# EAGLE design scheme (EAGLE 5.10)
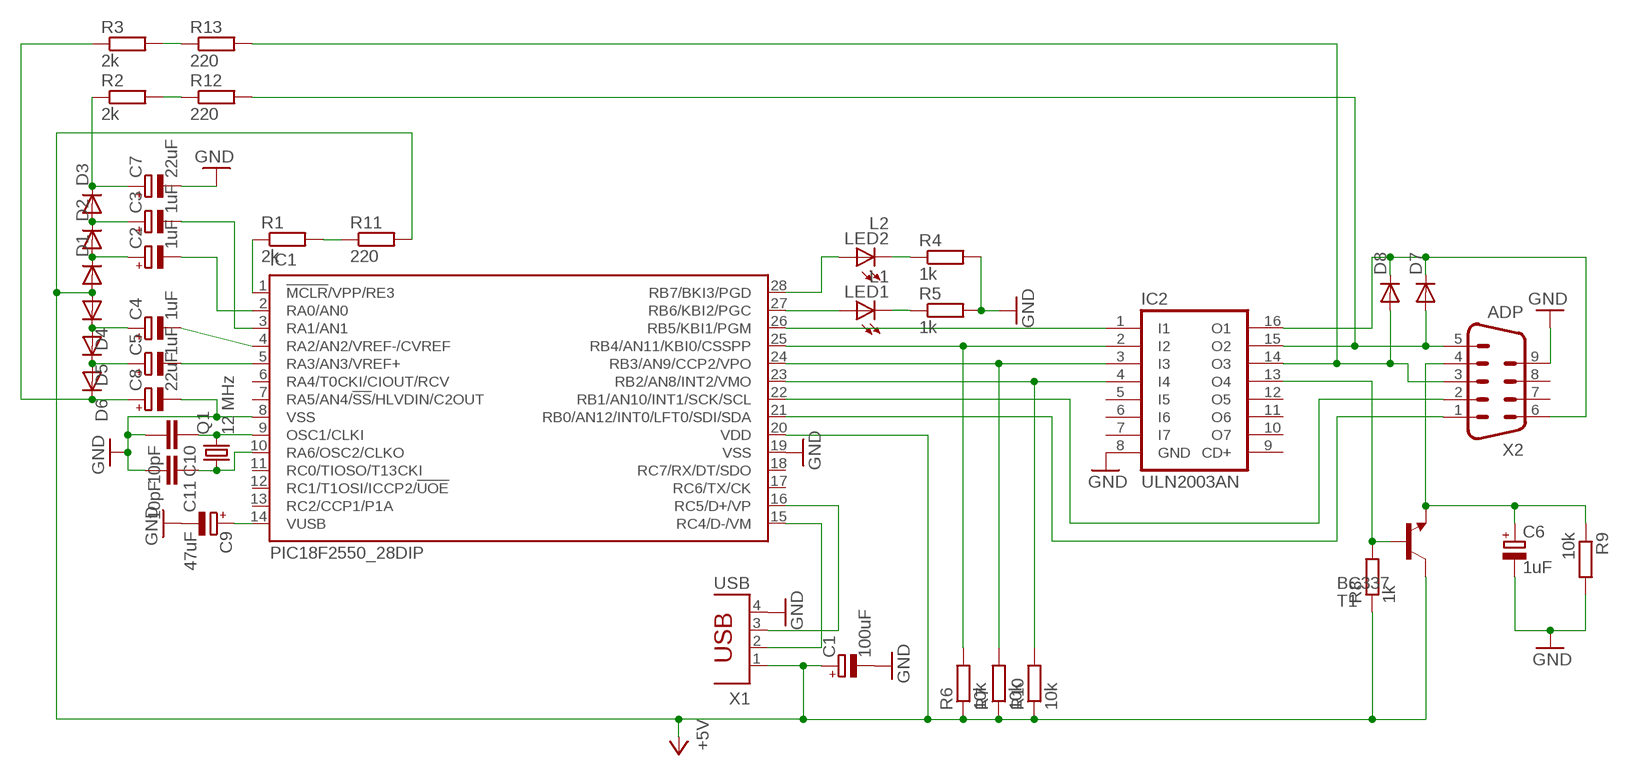
[diagram p0: schematic, sheet 1]

## Parts
C1  100uF  CPOL-EUE2,5-6E  [E2,5-6E]
C2  1uF  CPOL-EUE2-5  [E2-5]
C3  1uF  CPOL-EUE2-5  [E2-5]
C4  1uF  CPOL-EUE2-5  [E2-5]
C5  1uF  CPOL-EUE2-5  [E2-5]
C6  1uF  CPOL-EUE2-5  [E2-5]
C7  22uF  CPOL-EUE2-5  [E2-5]
C8  22uF  CPOL-EUE2-5  [E2-5]
C9  47uF  CPOL-EUE2,5-6E  [E2,5-6E]
C10  10pF  C-EU050-024X044  [C050-024X044]
C11  10pF  C-EU050-024X044  [C050-024X044]
D1  1N4148DO35-7  [DO35-7]
D2  1N4148DO35-7  [DO35-7]
D3  1N4148DO35-7  [DO35-7]
D4  1N4148DO35-7  [DO35-7]
D5  1N4148DO35-7  [DO35-7]
D6  1N4148DO35-7  [DO35-7]
D7  1N4148DO35-7  [DO35-7]
D8  1N4148DO35-7  [DO35-7]
IC1  PIC18F2550_28DIP  [DIL28-3]
IC2  ULN2003AN  [DIL16]
LED1  L1  LED5MM  [LED5MM]
LED2  L2  LED5MM  [LED5MM]
Q1  12 MHz  CRYSTALHC49S  [HC49/S]
R1  2k  R-EU_0204/7  [0204/7]
R2  2k  R-EU_0204/7  [0204/7]
R3  2k  R-EU_0204/7  [0204/7]
R4  1k  R-EU_0204/7  [0204/7]
R5  1k  R-EU_0204/7  [0204/7]
R6  10k  R-EU_0204/7  [0204/7]
R7  10k  R-EU_0204/7  [0204/7]
R8  1k  R-EU_0204/7  [0204/7]
R9  10k  R-EU_0204/7  [0204/7]
R10  10k  R-EU_0204/7  [0204/7]
R11  220  R-EU_0204/7  [0204/7]
R12  220  R-EU_0204/7  [0204/7]
R13  220  R-EU_0204/7  [0204/7]
T1  BC337  [TO92]
X1  USB  PN87520  [PN87520]
X2  ADP  M09-182  [182-009-MALE]

## Nets
+5V: C1.+ D1.A D4.A IC1.20(VDD) R6.1 R7.1 R8.1 R10.1 R11.2 T1.3(C) X1.1
GND: C1.- C6.- C7.- C8.- C9.- C10.2 C11.2 IC1.8(VSS) IC1.19(VSS) IC2.8(GND) R4.2 R5.2 R9.2 X1.4 X2.9
N$1: IC1.15(RC4/D-/VM) X1.2
N$2: IC1.16(RC5/D+/VP) X1.3
N$3: IC1.27(RB6/KBI2/PGC) LED1.A
N$4: C9.+ IC1.14(VUSB)
N$5: IC1.1(!MCLR!/VPP/RE3) R1.1
N$6: C2.+ D1.C D2.A
N$7: R1.2 R11.1
N$8: C2.- IC1.2(RA0/AN0)
N$9: C3.+ D2.C D3.A
N$10: C3.- IC1.3(RA1/AN1)
N$11: C10.1 IC1.9(OSC1/CLKI) Q1.2
N$12: C7.+ D3.C R2.1
N$13: R2.2 R12.1
N$14: C4.- IC1.4(RA2/AN2/VREF-/CVREF)
N$15: C4.+ D4.C D5.A
N$16: C5.- IC1.5(RA3/AN3/VREF+)
N$18: R3.2 R13.1
N$19: C11.1 IC1.10(RA6/OSC2/CLKO) Q1.1
N$21: IC1.24(RB3/AN9/CCP2/VPO) IC2.3(I3) R7.2
N$22: LED2.K(C) R4.1
N$23: LED1.K(C) R5.1
N$24: IC1.28(RB7/BKI3/PGD) LED2.A
N$26: D7.A IC2.15(O2) R12.2 X2.5
N$27: IC1.23(RB2/AN8/INT2/VMO) IC2.4(I4) R10.2
N$28: D7.C D8.C IC2.16(O1) X2.6
N$29: IC1.26(RB5/KBI1/PGM) IC2.1(I1)
N$30: D8.A IC2.14(O3) R13.2 X2.3
N$31: IC1.25(RB4/AN11/KBI0/CSSPP) IC2.2(I2) R6.2
N$33: C5.+ D5.C D6.A
N$35: C8.+ D6.C R3.1
N$40: IC2.13(O4) R8.2 T1.2(B)
N$41: IC1.22(RB1/AN10/INT1/SCK/SCL) X2.2
N$42: C6.+ R9.1 T1.1(E) X2.4
N$43: IC1.21(RB0/AN12/INT0/LFT0/SDI/SDA) X2.1
Unconnected: IC1.6(RA4/T0CKI/CIOUT/RCV) IC1.7(RA5/AN4/!SS!/HLVDIN/C2OUT) IC1.11(RC0/TIOSO/T13CKI) IC1.12(RC1/T1OSI/ICCP2/!UOE) IC1.13(RC2/CCP1/P1A) IC1.17(RC6/TX/CK) IC1.18(RC7/RX/DT/SDO) IC2.5(I5) IC2.6(I6) IC2.7(I7) IC2.9(CD+) IC2.10(O7) IC2.11(O6) IC2.12(O5) X2.7 X2.8

## Library data of the parts
C1-C9 = resistor:CPOL-EU: POLARIZED CAPACITOR, European symbol
C10 C11 = resistor:C-EU: CAPACITOR, European symbol
D1-D8 = diode:1N4148: DIODE high speed (Philips)
IC1 = microchip:PIC18F2*_28: USB Microcontrollers with nanoWatt Technology High-Performance, Enhanced Flash, 28/40/44-Pin, Source: http://ww1.microchip.com/downloads/en/devicedoc/39632c.pdf
IC2 = uln-udn:ULN2003A: DRIVER ARRAY
LED1 LED2 = led:LED: LED OSRAM: - CHIPLED LG R971, LG N971, LY N971, LG Q971, LY Q971, LO R971, LY R971 LH N974, LH R974 LS Q976, LO Q976, LY Q976 LO Q996 - Hyper CHIPLED LW Q18S LB Q993, LB Q99A, LB R99A - SideLED LS A670, LO A670, LY A670, LG A670, LP A670 LB A673, LV A673, LT A673, LW A673 LH A674 LY A675 LS A676, LA A676, LO A676, LY A676, LW A676 LS A679, LY A679, LG A679 - Hyper Micro SIDELED® LS Y876, LA Y876, LO Y876, LY Y876 LT Y87S - SmartLED LW L88C, LW L88S LB L89C, LB L89S, LG L890 LS L89K, LO L89K, LY L89K LS L896, LA L896, LO L896, LY L896 - TOPLED LS T670, LO T670, LY T670, LG T670, LP T670 LSG T670, LSP T670, LSY T670, LOP T670, LYG T670 LG T671, LOG T671, LSG T671 LB T673, LV T673, LT T673, LW T673 LH T674 LS T676, LA T676, LO T676, LY T676, LB T676, LH T676, LSB T676, LW T676 LB T67C, LV T67C, LT T67C, LS T67K, LO T67K, LY T67K, LW E67C LS E67B, LA E67B, LO E67B, LY E67B, LB E67C, LV E67C, LT E67C LW T67C LS T679, LY T679, LG T679 LS T770, LO T770, LY T770, LG T770, LP T770 LB T773, LV T773, LT T773, LW T773 LH T774 LS E675, LA E675, LY E675, LS T675 LS T776, LA T776, LO T776, LY T776, LB T776 LHGB T686 LT T68C, LB T68C - Hyper Mini TOPLED® LB M676 - Mini TOPLED Santana® LG M470 LS M47K, LO M47K, LY M47K Source: http://www.osram.convergy.de LUXEON: - LUMILED® LXK2-PW12-R00, LXK2-PW12-S00, LXK2-PW14-U00, LXK2-PW14-V00 LXK2-PM12-R00, LXK2-PM12-S00, LXK2-PM14-U00 LXK2-PE12-Q00, LXK2-PE12-R00, LXK2-PE12-S00, LXK2-PE14-T00, LXK2-PE14-U00 LXK2-PB12-K00, LXK2-PB12-L00, LXK2-PB12-M00, LXK2-PB14-N00, LXK2-PB14-P00, LXK2-PB14-Q00 LXK2-PR12-L00, LXK2-PR12-M00, LXK2-PR14-Q00, LXK2-PR14-R00 LXK2-PD12-Q00, LXK2-PD12-R00, LXK2-PD12-S00 LXK2-PH12-R00, LXK2-PH12-S00 LXK2-PL12-P00, LXK2-PL12-Q00, LXK2-PL12-R00 Source: www.luxeon.com KINGBRIGHT: KA-3528ASYC Source: www.kingbright.com
Q1 = crystal:CRYSTAL: CRYSTAL
R1-R13 = resistor:R-EU_: RESISTOR, European symbol
T1 = transistor:BC337: NPN TRANSISTOR
X1 = con-berg:PN87520: BERG USB connector
X2 = con-subd:M09: SUB-D

## Board
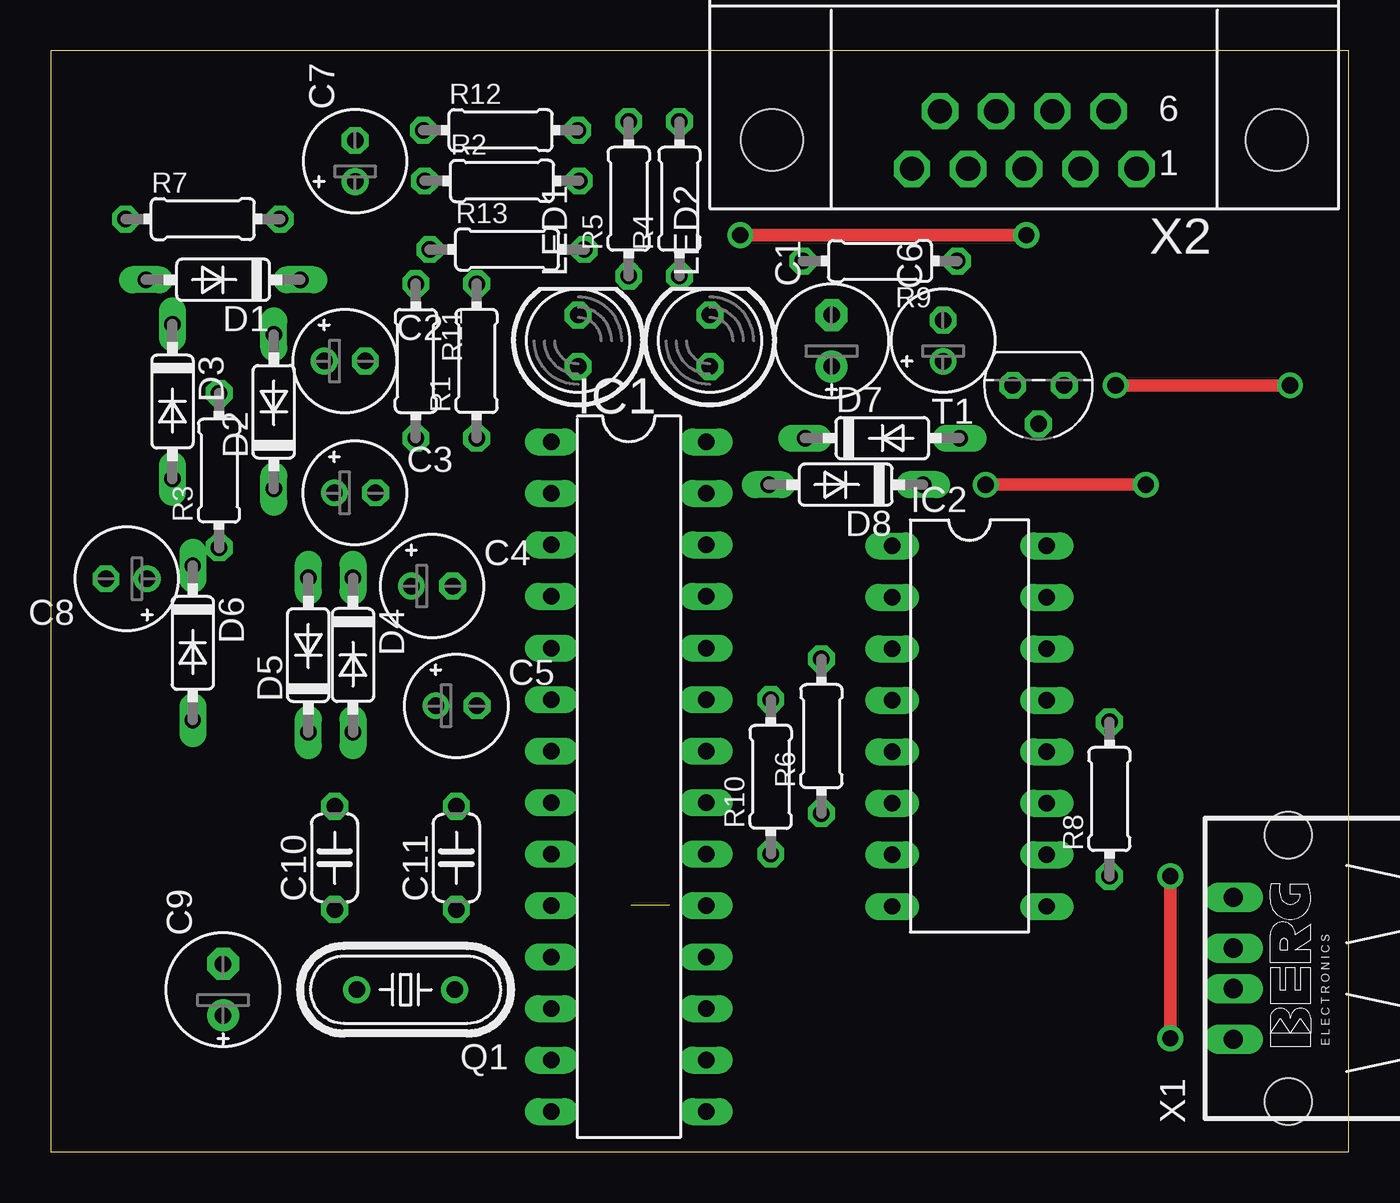
[diagram p1: board, top side]
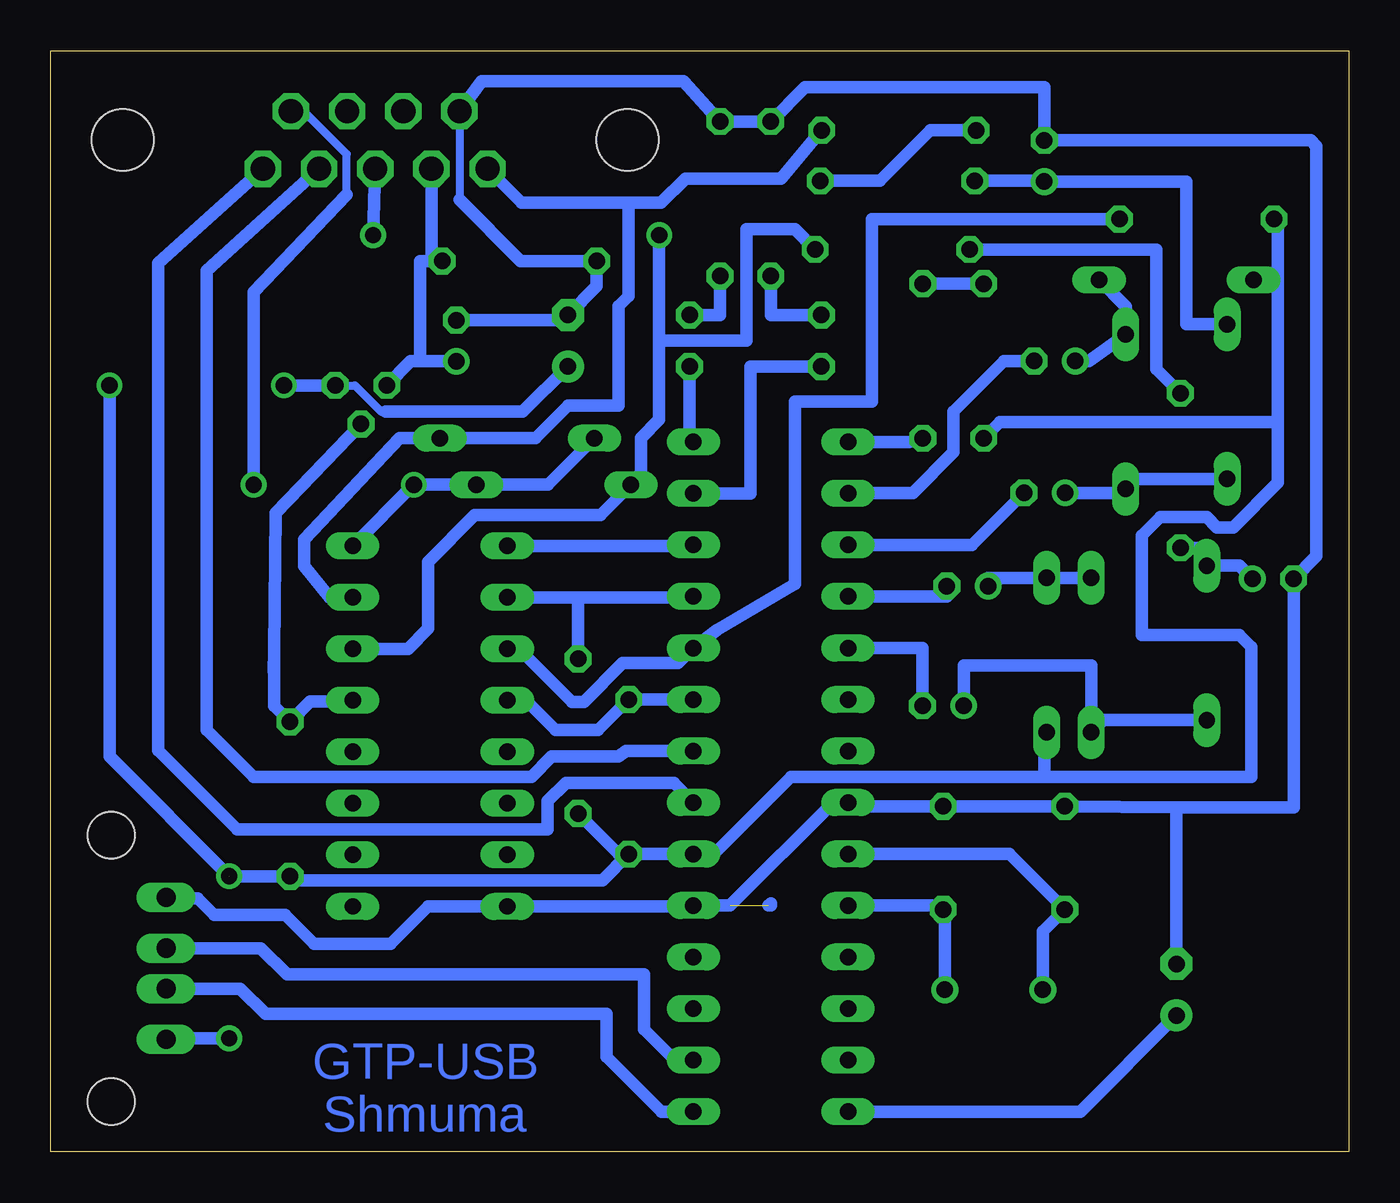
[diagram p2: board, bottom side, seen from below]

Size 64 x 54.3 mm. Coordinates in mm from the lower left corner, seen from the top.
Outline: 0,0 64,0 64,54.3 0,54.3 0,0
Copper layers (1*16): Top 0.035mm / dielectric 1.5mm / Bottom 0.035mm
Design rules "default": minimum track width 10mil, minimum drill 24mil, track to track 8mil, track to pad 8mil, pad to pad 8mil, via to via 8mil, smd to smd 8mil, copper to edge 40mil, drill to drill 8mil, minimum pad ring 10mil, minimum via ring 8mil, stop-mask expansion 4mil, vias tented up to drill 0mil, thermal gap 10mil

### Footprints (pad centres in the part's own frame; a part is rotated, then mirrored left to right if it is on the bottom)
E2,5-6E = drill 0.813 pad 1.575 round: + -1.27,0 | drill 0.813 pad 1.575 octagon: - 1.27,0
E2-5 = drill 0.813 pad 1.27 round: + -1.016,0 | drill 0.813 pad 1.27 octagon: - 1.016,0
C050-024X044 = drill 0.813 octagon: 1 -2.54,0; 2 2.54,0
DO35-7 = drill 0.813 long: A 3.81,0; C -3.81,0
DIL28-3 = drill 0.813 long: 1 -16.51,-3.81; 2 -13.97,-3.81; 3 -11.43,-3.81; 4 -8.89,-3.81; 5 -6.35,-3.81; 6 -3.81,-3.81; 7 -1.27,-3.81; 8 1.27,-3.81; 9 3.81,-3.81; 10 6.35,-3.81; 11 8.89,-3.81; 12 11.43,-3.81; 13 13.97,-3.81; 14 16.51,-3.81; 15 16.51,3.81; 16 13.97,3.81; 17 11.43,3.81; 18 8.89,3.81; 19 6.35,3.81; 20 3.81,3.81; 21 1.27,3.81; 22 -1.27,3.81; 23 -3.81,3.81; 24 -6.35,3.81; 25 -8.89,3.81; 26 -11.43,3.81; 27 -13.97,3.81; 28 -16.51,3.81
DIL16 = drill 0.813 long: 1 -8.89,-3.81; 2 -6.35,-3.81; 3 -3.81,-3.81; 4 -1.27,-3.81; 5 1.27,-3.81; 6 3.81,-3.81; 7 6.35,-3.81; 8 8.89,-3.81; 9 8.89,3.81; 10 6.35,3.81; 11 3.81,3.81; 12 1.27,3.81; 13 -1.27,3.81; 14 -3.81,3.81; 15 -6.35,3.81; 16 -8.89,3.81
LED5MM = drill 0.813 octagon: A -1.27,0; K 1.27,0
HC49/S = drill 0.813 round: 1 -2.413,0; 2 2.413,0
0204/7 = drill 0.813 octagon: 1 -3.81,0; 2 3.81,0
TO92 = drill 0.813 octagon: 1 1.27,0; 2 0,1.905; 3 -1.27,0
PN87520 = drill 0.95 long: 1 -3.5,2.71; 2 -1,2.71; 3 1,2.71; 4 3.5,2.71 | hole 2.3: -6.57,0; 6.57,0
182-009-MALE = drill 1.194 pad 1.524 octagon: 1 -5.537,10.923; 2 -2.769,10.923; 3 0,10.923; 4 2.769,10.923; 5 5.537,10.923; 6 -4.153,8.08; 7 -1.384,8.08; 8 1.384,8.08; 9 4.153,8.08 | hole 3.048: -12.446,9.501; 12.446,9.501

### Placement (x,y rotation side)
C1  38.5,40 90 top
C2  14.5,39 0 top
C3  15,32.5 0 top
C4  18.8,27.9 0 top
C5  20,22 0 top
C6  44,40 90 top
C7  15.01,48.86 90 top
C8  3.74,28.26 180 top
C9  8.5,8 90 top
C10  14,14.5 90 top
C11  20,14.5 90 top
D1  8.5,43 180 top
D2  11,36.5 90 top
D3  6,37 270 top
D4  14.9,24.5 270 top
D5  12.7,24.5 90 top
D6  7,25.1 270 top
D7  41,35.2 0 top
D8  39.2,32.9 180 top
IC1  28.5,18.5 270 top
IC2  45.3,21 270 top
LED1  26,40 90 top
LED2  32.5,40 90 top
Q1  17.5,8 180 top
R1  21,39 90 top
R2  22.25,47.88 0 top
R3  8.3,33.6 90 top
R4  31,47 90 top
R5  28.5,47 90 top
R6  38,20.5 90 top
R7  7.5,46 0 top
R8  52.2,17.4 90 top
R9  40.89,43.93 180 top
R10  35.5,18.5 90 top
R11  18,39 270 top
R12  22.18,50.38 0 top
R13  22.5,44.5 0 top
T1  48.7,37.8 180 top
X1  61.02,9.05 90 top
X2  48,59.4 180 top

### Tracks (layer width: path | path; a pad name or v marks a point on that pad's centre or on a via)
+5V  (via drill 0.8 pad 1.27)  (1 unrouted)
  Top 0.61: v61.1,37.8 v52.5,37.8 | v55.2,5.6 v55.2,13.6
  Bottom 0.406: 47.5,36.5 47.7,36.5 49,37.8 T1.3
  Bottom 0.61: R10.1 IC1.20 31.31,14.69 27.5,18.5 15,18.5 | R10.1 36,14.69 R6.1 | R11.2 17.19,36 3.5,36 | 3.5,36 3.5,43 | 3.5,43 3.5,46 R7.1 | 3.5,43 D1.A | R10.1 36.79,13.4 52.01,13.4 R8.1 v55.19,13.59 | 3.5,36 3.5,33 5.7,30.8 6.5,30.8 7,31.3 9.3,31.3 10.2,30.4 10.2,25.5 5.4,25.5 4.8,24.9 4.8,18.5 15,18.5 | D4.A 14.9,20.8 15,20.8 15,18.5 | C1.+ 40.73,36.5 47.5,36.5 | v52.5,37.8 T1.3 | v55.2,13.6 61.1,19.5 v61.1,37.8 | X1.1 58.26,5.6 v55.2,5.6
GND  (1 unrouted)
  Bottom 0.406: X2.9 43.85,46.95
  Bottom 0.61: 28.5,12.15 28.6,12.15 28.5,12.25 | C6.- 38.75,41.02 C1.- 37.08,42.69 R9.2 40.83,43.93 43.85,46.95 | X2.9 42.77,52.8 32.79,52.8 R4.2 R5.2 26.81,52.5 15.01,52.5 C7.- 1.88,49.88 1.6,49.6 1.6,29.38 C8.- 2.72,17 8.5,17 | X1.4 58.26,12.5 56.75,12.5 55.95,11.7 52.45,11.7 51,10.25 47.25,10.25 45.39,12.11 IC2.8 32.31,12.11 IC1.19 30.5,12.15 25.42,17.23 IC1.8 24.5,17.04 C11.2 C10.2 8.5,17 | C9.- 8.5,17
N$1
  Bottom 0.61: IC1.15 33.89,1.99 36.6,4.7 36.6,6.8 53.4,6.8 54.65,8.05 X1.2
N$2
  Bottom 0.61: IC1.16 33.23,4.53 34.75,6.05 34.75,8.75 52.35,8.75 53.65,10.05 X1.3
N$3
  Bottom 0.61: LED1.A 29.5,38.73 29.5,32.47 IC1.27
N$4
  Bottom 0.61: C9.+ 13.24,1.99 IC1.14
N$5
  Bottom 0.61: R1.1 21.68,35.01 IC1.1
N$6
  Bottom 0.61: C2.+ 12.81,39 D2.A 11,41.69 D1.C
N$7
  Bottom 0.61: R11.1 R1.2
N$8
  Bottom 0.61: C2.- 17,39 19.5,36.5 19.5,34.5 21.5,32.5 24.66,32.5 IC1.2
N$9
  Bottom 0.61: C3.+ 11.19,32.5 D2.C 10.5,33.19 D3.A
N$10
  Bottom 0.61: IC1.3 18.59,29.93 C3.-
N$11
  Bottom 0.61: IC1.9 16.73,14.69 C10.1 15.09,10.87 Q1.2
N$12
  Bottom 0.61: R2.1 15.01,47.88 C7.+ 8,47.84 8,40.81 D3.C
N$13
  Bottom 0.61: R12.1 20.62,50.38 23.12,47.88 R2.2
N$14
  Bottom 0.61: C4.- 19.82,27.39 IC1.4
N$15
  Bottom 0.61: D5.A D4.C 17.78,28.31 C4.+
N$16
  Bottom 0.61: C5.- 21.02,24.85 IC1.5
N$18
  Bottom 0.61: R13.1 9.5,44.5 9.5,38.61 R3.2
N$19
  Bottom 0.61: IC1.10 20.19,12.15 C11.1 20,12 19.91,11.91 Q1.1
N$21
  Bottom 0.61: 11.45,46 R7.2 23.5,46 23.5,37 27.3,37 27.3,28 31.15,25.75 IC1.24 33.06,24.1 35.8,24.1 37.7,22.2 38.3,22.2 40.9,24.8 IC2.3
N$22
  Bottom 0.61: LED2.K 31,41.27 R4.1
N$23
  Bottom 0.61: LED1.K 28.5,41.27 R5.1
N$24
  Bottom 0.61: IC1.28 32.5,35.01 LED2.A
N$26
  Bottom 0.61: IC2.15 50.25,27.35 51.5,28.9 51.5,30.2 46.8,35.2 D7.A 40.1,35.2 38.5,36.8 36,36.8 36,41.7 35.5,42.2 35.5,46.8 | R12.2 27.95,48.04 27.99,48 32.7,48 33.9,46.8 35.5,46.8 | X2.5 40.79,46.8 35.5,46.8
N$27
  Bottom 0.61: IC1.23 R10.2 37.01,20.8 39.1,20.8 40.57,22.27 IC2.4
N$28  (via drill 0.8 pad 1.27)
  Top 0.61: v46.1,32.9 v54,32.9
  Bottom 0.406: X2.6 51.52,51.32 49.4,49.2 49.4,47.2 | IC2.16 48.49,29.89
  Bottom 0.61: D7.C 39.49,32.9 D8.C v46.1,32.9 IC2.16 | 49.4,47.2 54,42.4 v54,32.9
N$29
  Bottom 0.61: IC1.26 32.35,29.89 IC2.1
N$30  (via drill 0.8 pad 1.27)
  Top 0.61: v34,45.2 v48.1,45.2
  Bottom 0.61: R13.2 27.31,45.5 29.7,45.5 29.7,40 34,40 | D8.A 34.9,32.9 | IC2.14 46.39,24.81 45.4,25.8 45.4,29.1 43.1,31.4 36.89,31.4 D8.A | 34,40 v34,45.2 | v48.1,45.2 X2.3 | 34,40 34,36.1 34.9,35.2 34.9,33.39 D8.A
N$31
  Bottom 0.61: IC1.25 32.35,27.35 37.8,27.35 38,27.35 | 38,27.35 IC2.2 | 38,27.35 R6.2
N$33
  Bottom 0.61: D6.A 12.1,21.29 D5.C 12.7,24 18.98,24 C5.+
N$35
  Bottom 0.61: R3.1 6.92,29.79 D6.C 5.41,28.91 C8.+
N$40
  Bottom 0.61: IC2.13 49.17,22.21 51.2,22.21 R8.2 52.99,22 52.99,24.7 | T1.2 52.9,31.49 52.99,24.7 | 52.99,24.7 53,23.7
N$41
  Bottom 0.61: IC1.22 35.63,19.77 36,19.5 39.3,19.5 40.3,18.5 54,18.5 56.3,20.8 56.3,43.45 X2.2
N$42
  Bottom 0.61: X2.4 45.23,44.46 arc-90 R9.1 45.8,43.93 45.8,38.98 C6.+ 46.25,38.98 T1.1
N$43
  Bottom 0.61: IC1.21 33.28,18.2 38.6,18.2 39.5,17.3 39.5,15.9 54.8,15.9 58.7,19.8 58.7,43.81 X2.1

### Text on the board
Bottom: GTP-USB | Shmuma